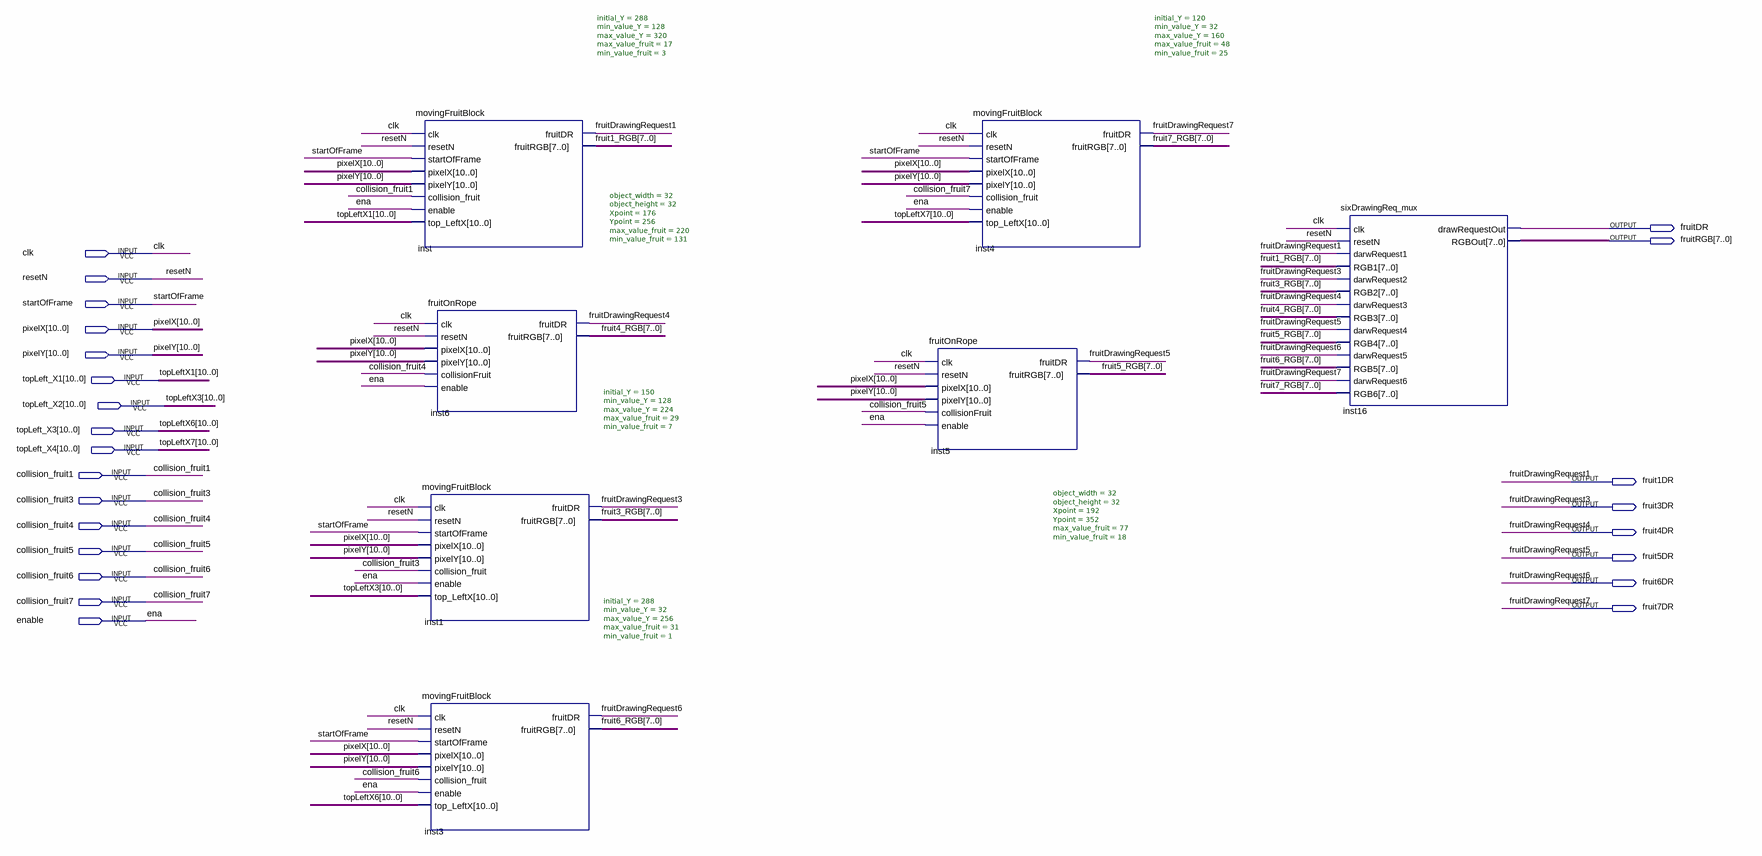
[diagram p0: schematic sheet]
// Quartus schematic ropeFruitBlock.bdf as structural Verilog: 7 symbols, 24 pins
module ropeFruitBlock (
  input  clk,
  input  resetN,
  input  startOfFrame,
  input  [10:0] pixelX,
  input  [10:0] pixelY,
  input  [10:0] topLeft_X1,
  input  [10:0] topLeft_X2,
  input  [10:0] topLeft_X3,
  input  [10:0] topLeft_X4,
  input  collision_fruit1,
  input  collision_fruit3,
  input  collision_fruit4,
  input  collision_fruit5,
  input  collision_fruit6,
  input  collision_fruit7,
  input  enable,
  output fruitDR,
  output [7:0] fruitRGB,
  output fruit1DR,
  output fruit3DR,
  output fruit4DR,
  output fruit5DR,
  output fruit6DR,
  output fruit7DR
);

  wire [7:0] fruit1_RGB, fruit3_RGB, fruit4_RGB, fruit5_RGB, fruit6_RGB, fruit7_RGB;

  movingFruitBlock #(.initial_Y(288), .min_value_Y(128), .max_value_Y(320), .max_value_fruit(17), .min_value_fruit(3)) inst (
    .clk(clk), .resetN(resetN), .startOfFrame(startOfFrame), .pixelX(pixelX), .pixelY(pixelY),
    .collision_fruit(collision_fruit1), .enable(enable), .top_LeftX(topLeft_X1), .fruitDR(fruit1DR),
    .fruitRGB(fruit1_RGB));
  fruitOnRope #(.object_width(32), .object_height(32), .Xpoint(176), .Ypoint(256), .max_value_fruit(220), .min_value_fruit(131)) inst6 (
    .clk(clk), .resetN(resetN), .pixelX(pixelX), .pixelY(pixelY), .collisionFruit(collision_fruit4),
    .enable(enable), .fruitDR(fruit4DR), .fruitRGB(fruit4_RGB));
  movingFruitBlock #(.initial_Y(150), .min_value_Y(128), .max_value_Y(224), .max_value_fruit(29), .min_value_fruit(7)) inst1 (
    .clk(clk), .resetN(resetN), .startOfFrame(startOfFrame), .pixelX(pixelX), .pixelY(pixelY),
    .collision_fruit(collision_fruit3), .enable(enable), .top_LeftX(topLeft_X2), .fruitDR(fruit3DR),
    .fruitRGB(fruit3_RGB));
  movingFruitBlock #(.initial_Y(288), .min_value_Y(32), .max_value_Y(256), .max_value_fruit(31), .min_value_fruit(1)) inst3 (
    .clk(clk), .resetN(resetN), .startOfFrame(startOfFrame), .pixelX(pixelX), .pixelY(pixelY),
    .collision_fruit(collision_fruit6), .enable(enable), .top_LeftX(topLeft_X3), .fruitDR(fruit6DR),
    .fruitRGB(fruit6_RGB));
  movingFruitBlock #(.initial_Y(120), .min_value_Y(32), .max_value_Y(160), .max_value_fruit(48), .min_value_fruit(25)) inst4 (
    .clk(clk), .resetN(resetN), .startOfFrame(startOfFrame), .pixelX(pixelX), .pixelY(pixelY),
    .collision_fruit(collision_fruit7), .enable(enable), .top_LeftX(topLeft_X4), .fruitDR(fruit7DR),
    .fruitRGB(fruit7_RGB));
  fruitOnRope #(.object_width(32), .object_height(32), .Xpoint(192), .Ypoint(352), .max_value_fruit(77), .min_value_fruit(18)) inst5 (
    .clk(clk), .resetN(resetN), .pixelX(pixelX), .pixelY(pixelY), .collisionFruit(collision_fruit5),
    .enable(enable), .fruitDR(fruit5DR), .fruitRGB(fruit5_RGB));
  sixDrawingReq_mux inst16 (
    .clk(clk), .resetN(resetN), .darwRequest1(fruit1DR), .RGB1(fruit1_RGB), .darwRequest2(fruit3DR),
    .RGB2(fruit3_RGB), .darwRequest3(fruit4DR), .RGB3(fruit4_RGB), .darwRequest4(fruit5DR),
    .RGB4(fruit5_RGB), .darwRequest5(fruit6DR), .RGB5(fruit6_RGB), .darwRequest6(fruit7DR),
    .RGB6(fruit7_RGB), .drawRequestOut(fruitDR), .RGBOut(fruitRGB));

  // Other names for the same wires on the sheet: ena = enable; fruitDrawingRequest1 = fruit1DR;
  //   fruitDrawingRequest3 = fruit3DR; fruitDrawingRequest4 = fruit4DR; fruitDrawingRequest5 = fruit5DR;
  //   fruitDrawingRequest6 = fruit6DR; fruitDrawingRequest7 = fruit7DR; topLeftX1[10:0] = topLeft_X1;
  //   topLeftX3[10:0] = topLeft_X2; topLeftX6[10:0] = topLeft_X3; topLeftX7[10:0] = topLeft_X4
endmodule
